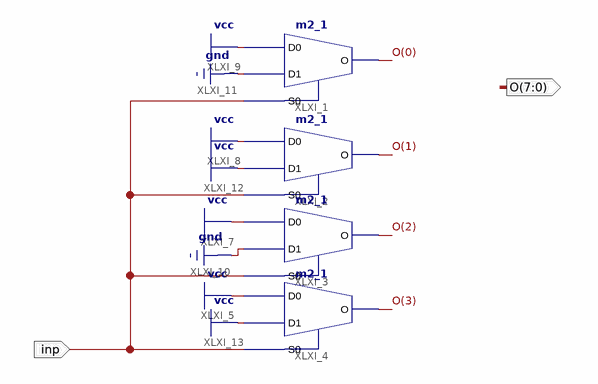
[diagram p0: schematic sheet 1]
// Xilinx ISE schematic AF.sch (spartan6) as structural Verilog: 4 symbols, 2 ports
module AF (
  input  inp,
  output [7:0] O
);

  m2_1 XLXI_1 (.D0(1'b1), .D1(1'b0), .S0(inp), .O(O[0]));
  m2_1 XLXI_2 (.D0(1'b1), .D1(1'b1), .S0(inp), .O(O[1]));
  m2_1 XLXI_3 (.D0(1'b1), .D1(1'b0), .S0(inp), .O(O[2]));
  m2_1 XLXI_4 (.D0(1'b1), .D1(1'b1), .S0(inp), .O(O[3]));
endmodule
